# Altium schematic sheet Top.SchDoc
size A3; SheetNumber: 1; SheetTotal: 7
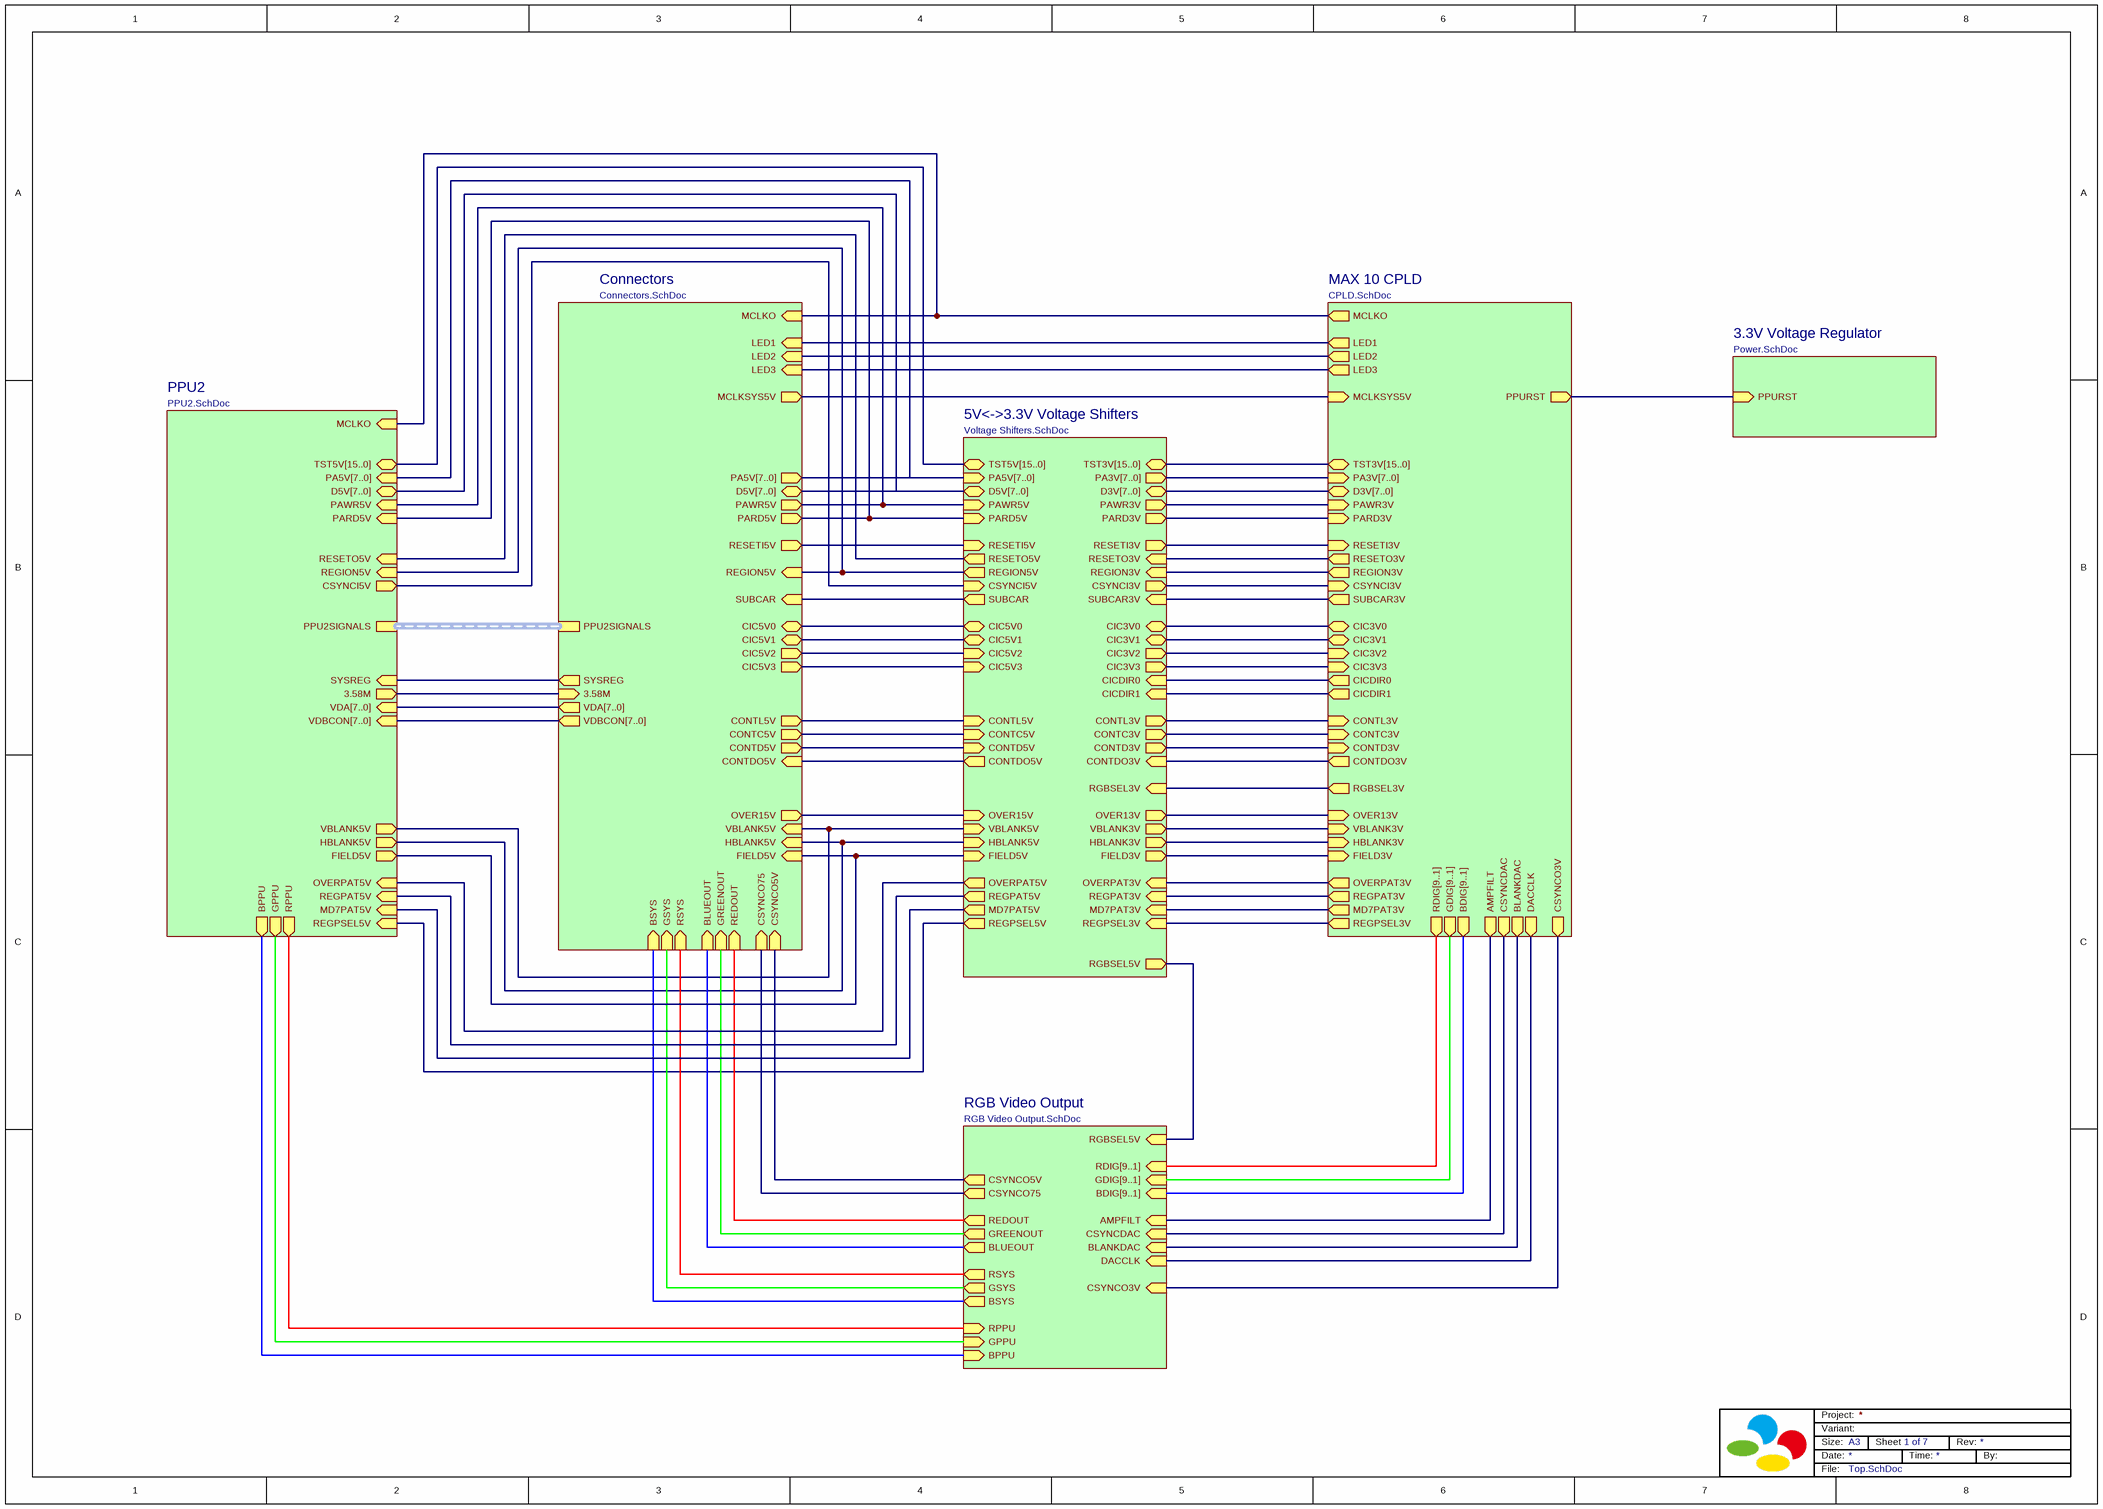
[diagram p0: Top.SchDoc]

## Sub-sheets
3.3V Voltage Regulator = Power.SchDoc: PPURST (in)
5V<->3.3V Voltage Shifters = Voltage Shifters.SchDoc: TST5V[15..0] (bidir), D3V[7..0] (bidir), TST3V[15..0] (bidir), CSYNCI5V (in), CSYNCI3V (out), RESETI5V (in), D5V[7..0] (bidir), REGION5V (out), RESETO5V (out), RGBSEL3V (in), PA5V[7..0] (in), PA3V[7..0] (out), SUBCAR (out), RESETO3V (in), RESETI3V (out), SUBCAR3V (in), PARD3V (out), PAWR3V (out), PAWR5V (in), PARD5V (in), REGION3V (in), RGBSEL5V (out), CONTL3V (out), CONTC3V (out), CONTDO3V (in), CONTD3V (out), CIC5V3 (in), CIC5V0 (bidir), CIC5V2 (in), CIC5V1 (bidir), CIC3V3 (out), CIC3V2 (out), CIC3V0 (bidir), CIC3V1 (bidir), CICDIR1 (in), CICDIR0 (in), CONTC5V (in), CONTDO5V (out), CONTL5V (in), CONTD5V (in), OVER15V (in), FIELD5V (in), OVER13V (out), FIELD3V (out), REGPAT3V (in), REGPSEL3V (in), MD7PAT3V (in), OVERPAT3V (in), HBLANK3V (out), VBLANK3V (out), REGPAT5V (out), MD7PAT5V (out), OVERPAT5V (out), REGPSEL5V (out), VBLANK5V (in), HBLANK5V (in)
Connectors = Connectors.SchDoc: SUBCAR (in), OVER15V (out), RESETI5V (out), MCLKO (in), PPU2SIGNALS (harness PPU2), FIELD5V (in), REGION5V (in), VDBCON[7..0] (out), VDA[7..0] (out), SYSREG (out), 3.58M (in), PAWR5V (out), PARD5V (out), PA5V[7..0] (out), D5V[7..0] (bidir), MCLKSYS5V (out), LED1 (in), LED2 (in), LED3 (in), CONTL5V (out), CONTC5V (out), CONTD5V (out), CONTDO5V (in), CIC5V2 (out), CIC5V3 (out), CIC5V0 (bidir), CIC5V1 (bidir), VBLANK5V (in), HBLANK5V (in), RSYS (in), GSYS (in), BSYS (in), CSYNCO5V (in), CSYNCO75 (in), REDOUT (in), GREENOUT (in), BLUEOUT (in)
MAX 10 CPLD = CPLD.SchDoc: BDIG[9..1] (out), TST3V[15..0] (bidir), PA3V[7..0] (in), RESETI3V (in), DACCLK (out), AMPFILT (out), RESETO3V (out), MCLKO (out), CSYNCO3V (out), CSYNCDAC (out), BLANKDAC (out), CSYNCI3V (in), PAWR3V (in), PARD3V (in), PPURST (out), REGION3V (out), D3V[7..0] (bidir), GDIG[9..1] (out), RDIG[9..1] (out), SUBCAR3V (out), LED2 (out), LED3 (out), LED1 (out), MCLKSYS5V (in), VBLANK3V (in), HBLANK3V (in), FIELD3V (in), CIC3V0 (bidir), RGBSEL3V (out), CONTL3V (in), CONTC3V (in), CONTDO3V (out), CONTD3V (in), CICDIR1 (out), CICDIR0 (out), CIC3V1 (bidir), CIC3V3 (in), CIC3V2 (in), OVER13V (in), OVERPAT3V (out), MD7PAT3V (out), REGPSEL3V (out), REGPAT3V (out)
PPU2 = PPU2.SchDoc: CSYNCI5V (out), RESETO5V (in), TST5V[15..0] (bidir), RPPU (out), GPPU (out), BPPU (out), PPU2SIGNALS (harness PPU2), MCLKO (in), REGION5V (in), REGPSEL5V (in), REGPAT5V (in), OVERPAT5V (in), MD7PAT5V (in), VBLANK5V (out), HBLANK5V (out), FIELD5V (out), VDA[7..0] (in), SYSREG (in), VDBCON[7..0] (in), 3.58M (out), PAWR5V (in), PARD5V (in), PA5V[7..0] (in), D5V[7..0] (bidir)
RGB Video Output = RGB Video Output.SchDoc: GDIG[9..1] (in), BDIG[9..1] (in), RDIG[9..1] (in), AMPFILT (in), CSYNCDAC (in), BLANKDAC (in), DACCLK (in), CSYNCO3V (in), RGBSEL5V (in), CSYNCO75 (out), RPPU (in), GPPU (in), BPPU (in), CSYNCO5V (out), RSYS (out), GSYS (out), BSYS (out), GREENOUT (out), REDOUT (out), BLUEOUT (out)

## Nets
(unnamed): sheet MAX 10 CPLD/RESETI3V, sheet 5V<->3.3V Voltage Shifters/RESETI3V
(unnamed): sheet MAX 10 CPLD/DACCLK, sheet RGB Video Output/DACCLK
(unnamed): sheet MAX 10 CPLD/AMPFILT, sheet RGB Video Output/AMPFILT
(unnamed): sheet MAX 10 CPLD/RESETO3V, sheet 5V<->3.3V Voltage Shifters/RESETO3V
(unnamed): sheet MAX 10 CPLD/MCLKO, sheet PPU2/MCLKO, sheet Connectors/MCLKO
(unnamed): sheet MAX 10 CPLD/CSYNCO3V, sheet RGB Video Output/CSYNCO3V
(unnamed): sheet MAX 10 CPLD/CSYNCDAC, sheet RGB Video Output/CSYNCDAC
(unnamed): sheet MAX 10 CPLD/BLANKDAC, sheet RGB Video Output/BLANKDAC
(unnamed): sheet MAX 10 CPLD/CSYNCI3V, sheet 5V<->3.3V Voltage Shifters/CSYNCI3V
(unnamed): sheet MAX 10 CPLD/PAWR3V, sheet 5V<->3.3V Voltage Shifters/PAWR3V
(unnamed): sheet MAX 10 CPLD/PARD3V, sheet 5V<->3.3V Voltage Shifters/PARD3V
(unnamed): sheet MAX 10 CPLD/PPURST, sheet 3.3V Voltage Regulator/PPURST
(unnamed): sheet MAX 10 CPLD/REGION3V, sheet 5V<->3.3V Voltage Shifters/REGION3V
(unnamed): sheet MAX 10 CPLD/SUBCAR3V, sheet 5V<->3.3V Voltage Shifters/SUBCAR3V
(unnamed): sheet MAX 10 CPLD/LED2, sheet Connectors/LED2
(unnamed): sheet MAX 10 CPLD/LED3, sheet Connectors/LED3
(unnamed): sheet MAX 10 CPLD/LED1, sheet Connectors/LED1
(unnamed): sheet MAX 10 CPLD/MCLKSYS5V, sheet Connectors/MCLKSYS5V
(unnamed): sheet MAX 10 CPLD/VBLANK3V, sheet 5V<->3.3V Voltage Shifters/VBLANK3V
(unnamed): sheet MAX 10 CPLD/HBLANK3V, sheet 5V<->3.3V Voltage Shifters/HBLANK3V
(unnamed): sheet MAX 10 CPLD/FIELD3V, sheet 5V<->3.3V Voltage Shifters/FIELD3V
(unnamed): sheet MAX 10 CPLD/CIC3V0, sheet 5V<->3.3V Voltage Shifters/CIC3V0
(unnamed): sheet MAX 10 CPLD/RGBSEL3V, sheet 5V<->3.3V Voltage Shifters/RGBSEL3V
(unnamed): sheet MAX 10 CPLD/CONTL3V, sheet 5V<->3.3V Voltage Shifters/CONTL3V
(unnamed): sheet MAX 10 CPLD/CONTC3V, sheet 5V<->3.3V Voltage Shifters/CONTC3V
(unnamed): sheet MAX 10 CPLD/CONTDO3V, sheet 5V<->3.3V Voltage Shifters/CONTDO3V
(unnamed): sheet MAX 10 CPLD/CONTD3V, sheet 5V<->3.3V Voltage Shifters/CONTD3V
(unnamed): sheet MAX 10 CPLD/CICDIR1, sheet 5V<->3.3V Voltage Shifters/CICDIR1
(unnamed): sheet MAX 10 CPLD/CICDIR0, sheet 5V<->3.3V Voltage Shifters/CICDIR0
(unnamed): sheet MAX 10 CPLD/CIC3V1, sheet 5V<->3.3V Voltage Shifters/CIC3V1
(unnamed): sheet MAX 10 CPLD/CIC3V3, sheet 5V<->3.3V Voltage Shifters/CIC3V3
(unnamed): sheet MAX 10 CPLD/CIC3V2, sheet 5V<->3.3V Voltage Shifters/CIC3V2
(unnamed): sheet MAX 10 CPLD/OVER13V, sheet 5V<->3.3V Voltage Shifters/OVER13V
(unnamed): sheet MAX 10 CPLD/OVERPAT3V, sheet 5V<->3.3V Voltage Shifters/OVERPAT3V
(unnamed): sheet MAX 10 CPLD/MD7PAT3V, sheet 5V<->3.3V Voltage Shifters/MD7PAT3V
(unnamed): sheet MAX 10 CPLD/REGPSEL3V, sheet 5V<->3.3V Voltage Shifters/REGPSEL3V
(unnamed): sheet MAX 10 CPLD/REGPAT3V, sheet 5V<->3.3V Voltage Shifters/REGPAT3V
(unnamed): sheet PPU2/CSYNCI5V, sheet 5V<->3.3V Voltage Shifters/CSYNCI5V
(unnamed): sheet PPU2/RESETO5V, sheet 5V<->3.3V Voltage Shifters/RESETO5V
(unnamed): sheet PPU2/RPPU, sheet RGB Video Output/RPPU
(unnamed): sheet PPU2/GPPU, sheet RGB Video Output/GPPU
(unnamed): sheet PPU2/BPPU, sheet RGB Video Output/BPPU
(unnamed): sheet PPU2/REGION5V, sheet 5V<->3.3V Voltage Shifters/REGION5V, sheet Connectors/REGION5V
(unnamed): sheet PPU2/REGPSEL5V, sheet 5V<->3.3V Voltage Shifters/REGPSEL5V
(unnamed): sheet PPU2/REGPAT5V, sheet 5V<->3.3V Voltage Shifters/REGPAT5V
(unnamed): sheet PPU2/OVERPAT5V, sheet 5V<->3.3V Voltage Shifters/OVERPAT5V
(unnamed): sheet PPU2/MD7PAT5V, sheet 5V<->3.3V Voltage Shifters/MD7PAT5V
(unnamed): sheet PPU2/VBLANK5V, sheet 5V<->3.3V Voltage Shifters/VBLANK5V, sheet Connectors/VBLANK5V
(unnamed): sheet PPU2/HBLANK5V, sheet 5V<->3.3V Voltage Shifters/HBLANK5V, sheet Connectors/HBLANK5V
(unnamed): sheet PPU2/FIELD5V, sheet 5V<->3.3V Voltage Shifters/FIELD5V, sheet Connectors/FIELD5V
(unnamed): sheet PPU2/SYSREG, sheet Connectors/SYSREG
(unnamed): sheet PPU2/3.58M, sheet Connectors/3.58M
(unnamed): sheet PPU2/PAWR5V, sheet 5V<->3.3V Voltage Shifters/PAWR5V, sheet Connectors/PAWR5V
(unnamed): sheet PPU2/PARD5V, sheet 5V<->3.3V Voltage Shifters/PARD5V, sheet Connectors/PARD5V
(unnamed): sheet RGB Video Output/RGBSEL5V, sheet 5V<->3.3V Voltage Shifters/RGBSEL5V
(unnamed): sheet RGB Video Output/CSYNCO75, sheet Connectors/CSYNCO75
(unnamed): sheet RGB Video Output/CSYNCO5V, sheet Connectors/CSYNCO5V
(unnamed): sheet RGB Video Output/RSYS, sheet Connectors/RSYS
(unnamed): sheet RGB Video Output/GSYS, sheet Connectors/GSYS
(unnamed): sheet RGB Video Output/BSYS, sheet Connectors/BSYS
(unnamed): sheet RGB Video Output/GREENOUT, sheet Connectors/GREENOUT
(unnamed): sheet RGB Video Output/REDOUT, sheet Connectors/REDOUT
(unnamed): sheet RGB Video Output/BLUEOUT, sheet Connectors/BLUEOUT
(unnamed): sheet 5V<->3.3V Voltage Shifters/RESETI5V, sheet Connectors/RESETI5V
(unnamed): sheet 5V<->3.3V Voltage Shifters/SUBCAR, sheet Connectors/SUBCAR
(unnamed): sheet 5V<->3.3V Voltage Shifters/CIC5V3, sheet Connectors/CIC5V3
(unnamed): sheet 5V<->3.3V Voltage Shifters/CIC5V0, sheet Connectors/CIC5V0
(unnamed): sheet 5V<->3.3V Voltage Shifters/CIC5V2, sheet Connectors/CIC5V2
(unnamed): sheet 5V<->3.3V Voltage Shifters/CIC5V1, sheet Connectors/CIC5V1
(unnamed): sheet 5V<->3.3V Voltage Shifters/CONTC5V, sheet Connectors/CONTC5V
(unnamed): sheet 5V<->3.3V Voltage Shifters/CONTDO5V, sheet Connectors/CONTDO5V
(unnamed): sheet 5V<->3.3V Voltage Shifters/CONTL5V, sheet Connectors/CONTL5V
(unnamed): sheet 5V<->3.3V Voltage Shifters/CONTD5V, sheet Connectors/CONTD5V
(unnamed): sheet 5V<->3.3V Voltage Shifters/OVER15V, sheet Connectors/OVER15V

## Buses and harness runs
bus sheet 5V<->3.3V Voltage Shifters/D3V[7..0] = sheet MAX 10 CPLD/D3V[7..0]
bus sheet 5V<->3.3V Voltage Shifters/D5V[7..0] = sheet Connectors/D5V[7..0] = sheet PPU2/D5V[7..0]
bus sheet 5V<->3.3V Voltage Shifters/PA3V[7..0] = sheet MAX 10 CPLD/PA3V[7..0]
bus sheet 5V<->3.3V Voltage Shifters/PA5V[7..0] = sheet Connectors/PA5V[7..0] = sheet PPU2/PA5V[7..0]
bus sheet 5V<->3.3V Voltage Shifters/TST3V[15..0] = sheet MAX 10 CPLD/TST3V[15..0]
bus sheet 5V<->3.3V Voltage Shifters/TST5V[15..0] = sheet PPU2/TST5V[15..0]
bus sheet Connectors/VDA[7..0] = sheet PPU2/VDA[7..0]
bus sheet Connectors/VDBCON[7..0] = sheet PPU2/VDBCON[7..0]
bus sheet MAX 10 CPLD/BDIG[9..1] = sheet RGB Video Output/BDIG[9..1]
bus sheet MAX 10 CPLD/GDIG[9..1] = sheet RGB Video Output/GDIG[9..1]
bus sheet MAX 10 CPLD/RDIG[9..1] = sheet RGB Video Output/RDIG[9..1]
harness sheet Connectors/PPU2SIGNALS = sheet PPU2/PPU2SIGNALS

## Notes on the sheet
- Size:
- Date:
- Variant:
- Project:
- A3
- Sheet
- Time:
- Rev:
- By:
- File: